# Altium project ControlBoard.PrjPCB
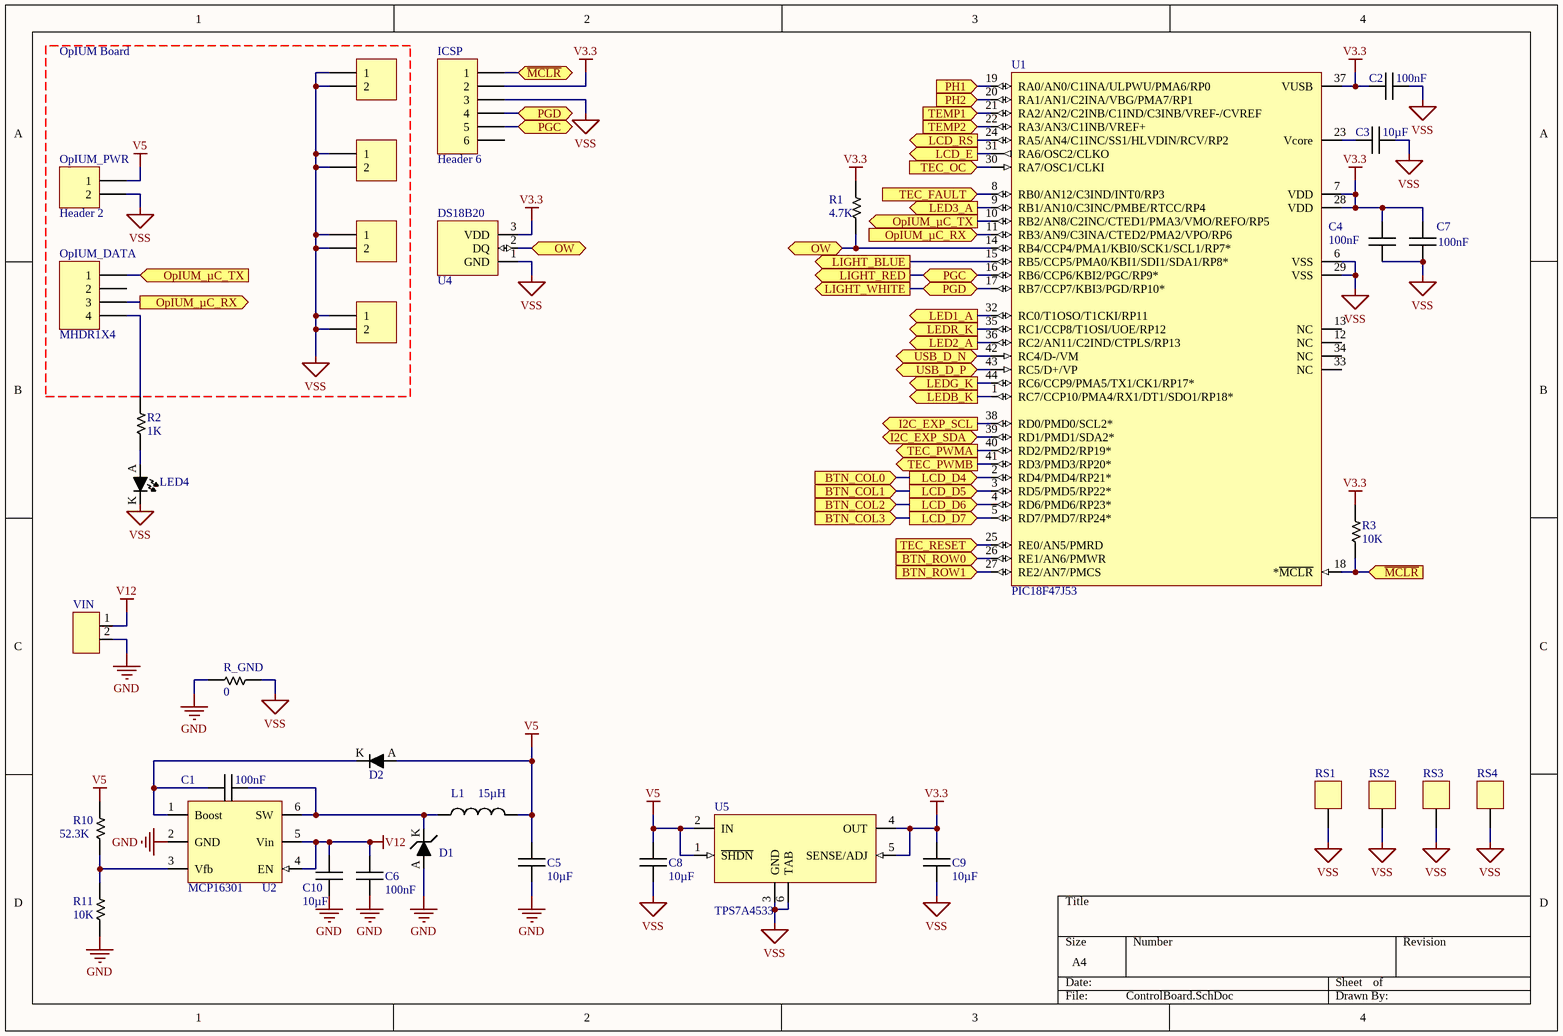
[diagram p0: ControlBoard.SchDoc]
3 sheets, 137 parts. Net scope: flat (ports and power ports of the same name join across sheets).
Board file: ControlBoard.PcbDoc
Sheets:
  ControlBoard.SchDoc
  PowerBoard.SchDoc
  IOBoard.SchDoc

## Sheet ControlBoard.SchDoc
size A4

### Parts
C1  100nF  [CAPC1608N]
C2  100nF  [CAPC1608N]
C3  10µF  [CAPC2012N]
C4  100nF  [CAPC1608N]
C5  10µF  [CAPC2012N]
C6  100nF  [CAPC1608N]
C7  100nF  [CAPC1608N]
C8  10µF  [CAPC2012N]
C9  10µF  [CAPC2012N]
C10  10µF  [CAPC3225N]
D1  Schottky Diode  [DO-214AC]  (value not drawn)
D2  Diode  [SOT323]  (value not drawn)
ICSP  Header 6  [HDR1X6]
L1  15µH  [INDUCTOR 6×6mm Taiyo Yuden]
LED4  (no value)  [LED 1608m]
OpIUM_DATA  MHDR1X4  [MHDR1X4]
OpIUM_PWR  Header 2  [HDR1X2]
R1  4.7K  [RESC1608N]
R2  1K  [RESC1608N]
R3  10K  [RESC1608N]
R10  52.3K  [RESC1608N]
R11  10K  [RESC1608N]
R_GND  0  [RESC1608N]
RS1  PCB Riser  [PCB Riser 6×10mm 3mm]  (value not drawn)
RS2  PCB Riser  [PCB Riser 6×10mm 3mm]  (value not drawn)
RS3  PCB Riser  [PCB Riser 6×10mm 3mm]  (value not drawn)
RS4  PCB Riser  [PCB Riser 6×10mm 3mm]  (value not drawn)
SUPPORT1  MHDR1X2  [MHDR1X2]  (value not drawn)
SUPPORT2  MHDR1X2  [MHDR1X2]  (value not drawn)
SUPPORT3  MHDR1X2  [MHDR1X2]  (value not drawn)
SUPPORT4  MHDR1X2  [MHDR1X2]  (value not drawn)
U1  PIC18F47J53  [TQFP-PT44_N]
U2  MCP16301  [SOT23-6_N]
U4  DS18B20  [TO-92A]
U5  TPS7A4533  [SOT223-6N]
VIN  High-Power Connector 2p  [High-Power Connector 2]  (value not drawn)

### Ports
BTN_COL0 (in), BTN_COL1 (in), BTN_COL2 (in), BTN_COL3 (in), BTN_ROW0 (in), BTN_ROW1 (in), I2C_EXP_SCL (out), I2C_EXP_SDA (bidir), LCD_D4 (out), LCD_D5 (out), LCD_D6 (out), LCD_D7 (out), LCD_E (out), LCD_RS (out), LED1_A (out), LED2_A (out), LED3_A (out), LEDB_K (out), LEDG_K (out), LEDR_K (out), LIGHT_BLUE (out), LIGHT_RED (out), LIGHT_WHITE (out), OpIUM_µC_RX (in), OpIUM_µC_RX (out), OpIUM_µC_TX (in), OpIUM_µC_TX (out), OW (bidir), PGC (bidir), PGD (bidir), PH1 (in), PH2 (in), TEC_FAULT (in), TEC_OC (in), TEC_PWMA (out), TEC_PWMB (out), TEC_RESET (in), TEMP1 (in), TEMP2 (in), USB_D_N (bidir), USB_D_P (bidir), ~{MCLR} (bidir), ~{MCLR} (in)

### Nets
GND: C5.1 C6.2 C10.1 D1.A(Anode) R11.1 R_GND.1 U2.2(GND) VIN.2
V3.3: C2.2 C4.2 C7.2 C9.2 ICSP.2 R1.2 R3.2 U1.7(VDD) U1.28(VDD) U1.37(VUSB) U4.3(VDD) U5.4(OUT) U5.5(SENSE/ADJ)
V5: C5.2 C8.2 D2.A L1.2 OpIUM_PWR.1 R10.2 U5.1(~{SHDN}) U5.2(IN)
V12: C6.1 C10.2 U2.4(EN) U2.5(Vin) VIN.1
VSS: C2.1 C3.1 C4.1 C7.1 C8.1 C9.1 ICSP.3 LED4.K OpIUM_PWR.2 R_GND.2 RS1.1 RS2.1 RS3.1 RS4.1 SUPPORT1.1 SUPPORT1.2 SUPPORT2.1 SUPPORT2.2 SUPPORT3.1 SUPPORT3.2 SUPPORT4.1 SUPPORT4.2 U1.6(VSS) U1.29(VSS) U4.1(GND) U5.3(GND) U5.6(TAB)
USB_D_N: U1.42(RC4/D-/VM) ; port USB_D_N
USB_D_P: U1.43(RC5/D+/VP) ; port USB_D_P
NetB1_1: U1.27(RE2/AN7/PMCS) ; port BTN_ROW1
NetB1_2: U1.2(RD4/PMD4/RP21*) ; port LCD_D4, port BTN_COL0
NetB2_1: U1.26(RE1/AN6/PMWR) ; port BTN_ROW0
NetB3_2: U1.3(RD5/PMD5/RP22*) ; port LCD_D5, port BTN_COL1
NetB5_2: U1.4(RD6/PMD6/RP23*) ; port LCD_D6, port BTN_COL2
NetB7_2: U1.5(RD7/PMD7/RP24*) ; port LCD_D7, port BTN_COL3
NetC1_1: C1.1 D1.K(Kathode) L1.1 U2.6(SW)
NetC1_2: C1.2 D2.K U2.1(Boost)
NetC3_2: C3.2 U1.23(Vcore)
NetEXP_I2C_2: U1.38(RD0/PMD0/SCL2*) ; port I2C_EXP_SCL
NetEXP_I2C_3: U1.39(RD1/PMD1/SDA2*) ; port I2C_EXP_SDA
NetEXP_OW_2: R1.1 U1.14(RB4/CCP4/PMA1/KBI0/SCK1/SCL1/RP7*) U4.2(DQ) ; port OW
NetICSP_1: ICSP.1 R3.1 U1.18(*~{MCLR}) ; port ~{MCLR}
NetICSP_4: ICSP.4 U1.17(RB7/CCP7/KBI3/PGD/RP10*) ; port PGD, port LIGHT_WHITE
NetICSP_5: ICSP.5 U1.16(RB6/CCP6/KBI2/PGC/RP9*) ; port PGC, port LIGHT_RED
NetLCD_4: U1.24(RA5/AN4/C1INC/SS1/HLVDIN/RCV/RP2) ; port LCD_RS
NetLCD_6: U1.31(RA6/OSC2/CLKO) ; port LCD_E
NetLED1_AB: U1.32(RC0/T1OSO/T1CKI/RP11) ; port LED1_A
NetLED2_AB: U1.36(RC2/AN11/C2IND/CTPLS/RP13) ; port LED2_A
NetLED3_AB: U1.9(RB1/AN10/C3INC/PMBE/RTCC/RP4) ; port LED3_A
NetLED4_A: LED4.A R2.1
NetOpIUM_DATA_1: OpIUM_DATA.1 U1.10(RB2/AN8/C2INC/CTED1/PMA3/VMO/REFO/RP5) ; port OpIUM_µC_TX
NetOpIUM_DATA_3: OpIUM_DATA.3 U1.11(RB3/AN9/C3INA/CTED2/PMA2/VPO/RP6) ; port OpIUM_µC_RX
NetOpIUM_DATA_4: OpIUM_DATA.4 R2.2
NetR4_2: U1.35(RC1/CCP8/T1OSI/UOE/RP12) ; port LEDR_K
NetR5_2: U1.44(RC6/CCP9/PMA5/TX1/CK1/RP17*) ; port LEDG_K
NetR6_2: U1.1(RC7/CCP10/PMA4/RX1/DT1/SDO1/RP18*) ; port LEDB_K
NetR10_1: R10.1 R11.2 U2.3(Vfb)
NetR22_2: U1.25(RE0/AN5/PMRD) ; port TEC_RESET
NetR25_1: U1.15(RB5/CCP5/PMA0/KBI1/SDI1/SDA1/RP8*) ; port LIGHT_BLUE
NetR36_2: U1.19(RA0/AN0/C1INA/ULPWU/PMA6/RP0) ; port PH1
NetR37_2: U1.20(RA1/AN1/C2INA/VBG/PMA7/RP1) ; port PH2
NetTEMP1_2: U1.21(RA2/AN2/C2INB/C1IND/C3INB/VREF-/CVREF) ; port TEMP1
NetTEMP2_2: U1.22(RA3/AN3/C1INB/VREF+) ; port TEMP2
NetU1_8: U1.8(RB0/AN12/C3IND/INT0/RP3) ; port TEC_FAULT
NetU1_30: U1.30(RA7/OSC1/CLKI) ; port TEC_OC
NetU1_40: U1.40(RD2/PMD2/RP19*) ; port TEC_PWMA
NetU1_41: U1.41(RD3/PMD3/RP20*) ; port TEC_PWMB

Not connected (* = marked no-connect by the designer): ICSP 6; OpIUM_DATA 2; U1 12(NC) 13(NC) 33(NC) 34(NC)

### Notes on the sheet
- OpIUM Board

### Library data of the parts
C1 C6 = Capacitor: Voltage Rating: 50V; Value: 100nF
C2-C5 C7-C10 = Capacitor
  C2 C4 C7: Value: 100nF
  C3 C5 C8-C10: Value: 10µF
D1 = Schottky Diode: Model: SS14
D2 = Diode: pin to pad: A>1 K>3; Model: M1MA141KT1G
ICSP = Header 6: Header, 6-Pin; LatestRevisionDate: 17-Jul-2002; LatestRevisionNote: Re-released for DXP Platform.; Publisher: Altium Limited
L1 = Inductor: Value: 15µH
LED4 = LED: pin to pad: A>1 K>2
OpIUM_DATA = MHDR1X4: Header, 4-Pin; LatestRevisionDate: 17-Jul-2002; LatestRevisionNote: Re-released for DXP Platform.; Publisher: Altium Limited
OpIUM_PWR = Header 2: Header, 2-Pin; LatestRevisionDate: 17-Jul-2002; LatestRevisionNote: Re-released for DXP Platform.; Publisher: Altium Limited
R1-R3 R10 R11 R_GND = Resistor
  R1: Value: 4.7K
  R2: Value: 1K
  R3 R11: Value: 10K
  R10: Value: 52.3K
  R_GND: Value: 0
SUPPORT1-SUPPORT4 = MHDR1X2: Header, 2-Pin; LatestRevisionDate: 17-Jul-2002; LatestRevisionNote: Re-released for DXP Platform.; Publisher: Altium Limited
U5 = TPS7A45xx: VIN: 5V; VOUT: 3.3V
RS1-RS4 = PCB Riser: Height: 10mm
U2 = MCP16301: Vout: *

## Sheet PowerBoard.SchDoc
size A4
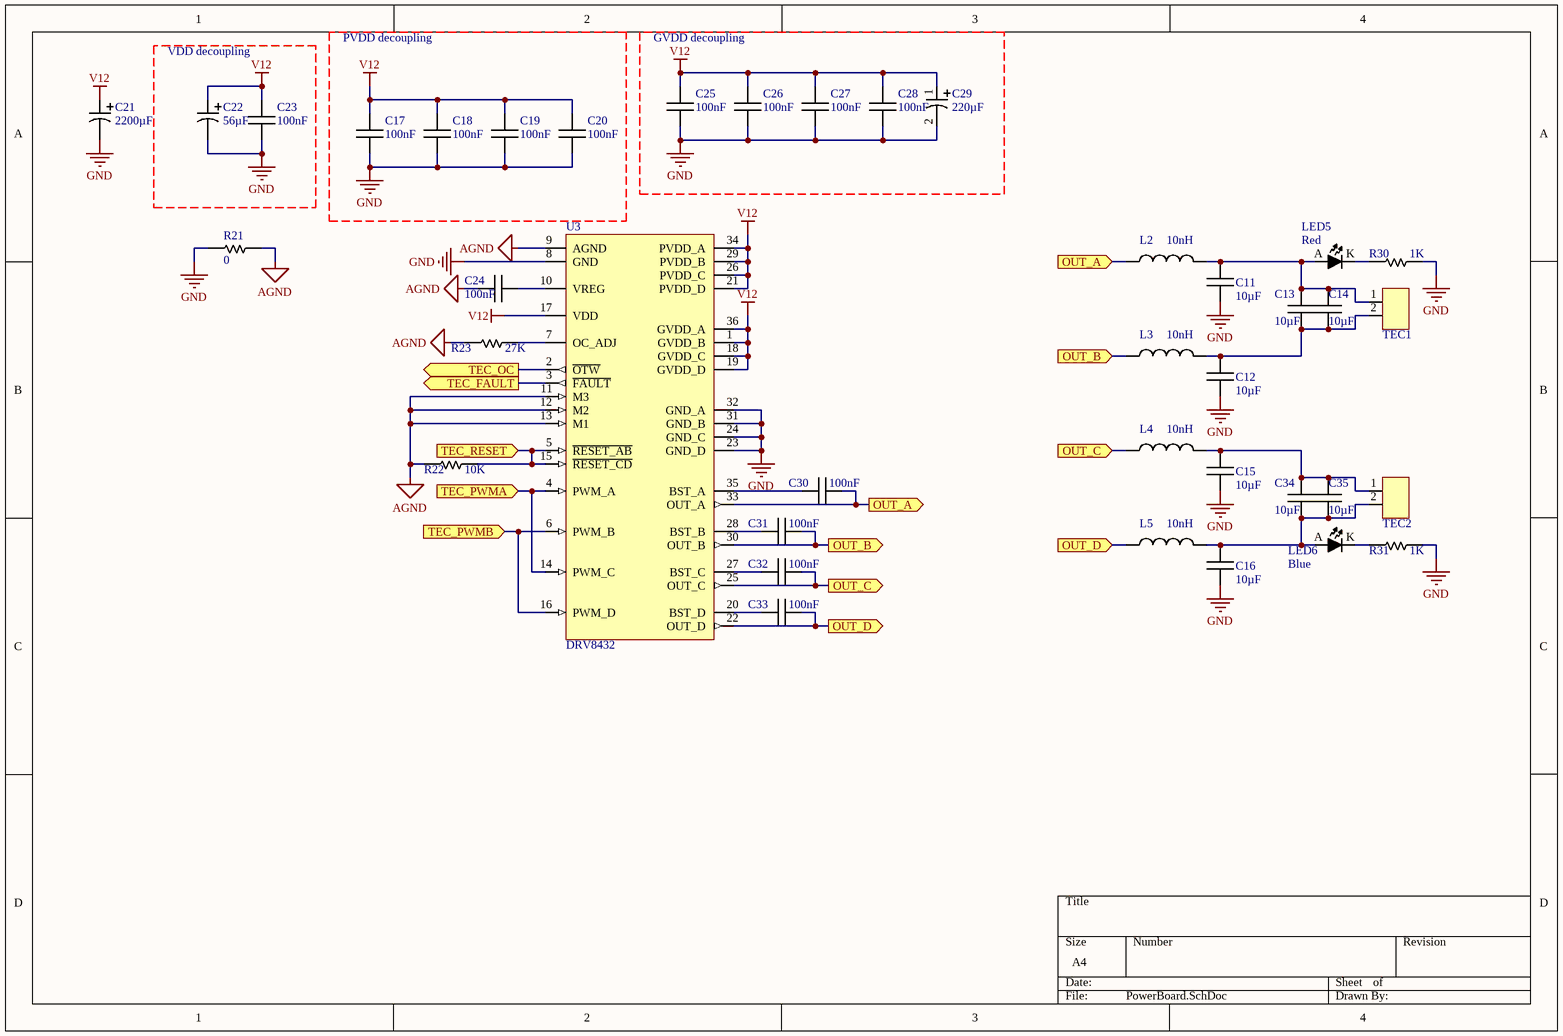
[diagram p1: PowerBoard.SchDoc]

### Parts
C11  10µF  [CAPC3225N]
C12  10µF  [CAPC3225N]
C13  10µF  [CAPC3225N]
C14  10µF  [CAPC3225N]
C15  10µF  [CAPC3225N]
C16  10µF  [CAPC3225N]
C17  100nF  [CAPC1608N]
C18  100nF  [CAPC1608N]
C19  100nF  [CAPC1608N]
C20  100nF  [CAPC1608N]
C21  2200µF  [CAPPR7.5-18x35.5]
C22  56µF  [CAPPR2.5-6.3x15]
C23  100nF  [CAPC1608N]
C24  100nF  [CAPC1608N]
C25  100nF  [CAPC1608N]
C26  100nF  [CAPC1608N]
C27  100nF  [CAPC1608N]
C28  100nF  [CAPC1608N]
C29  220µF  [CAPPR3.5-8x15]
C30  100nF  [CAPC1608N]
C31  100nF  [CAPC1608N]
C32  100nF  [CAPC1608N]
C33  100nF  [CAPC1608N]
C34  10µF  [CAPC3225N]
C35  10µF  [CAPC3225N]
L2  10nH  [Inductor 9.1×7.6mm TH]
L3  10nH  [Inductor 9.1×7.6mm TH]
L4  10nH  [Inductor 9.1×7.6mm TH]
L5  10nH  [Inductor 9.1×7.6mm TH]
LED5  Red  [LED 1608m]
LED6  Blue  [LED 1608m]
R21  0  [RESC1608N]
R22  10K  [RESC1608N]
R23  27K  [RESC2012N]
R30  1K  [RESC1608N]
R31  1K  [RESC1608N]
TEC1  High-Power Connector 2p  [High-Power Connector 2]  (value not drawn)
TEC2  High-Power Connector 2p  [High-Power Connector 2]  (value not drawn)
U3  DRV8432  [PSOP3-36]

### Ports
OUT_A (in), OUT_A (out), OUT_B (in), OUT_B (out), OUT_C (in), OUT_C (out), OUT_D (in), OUT_D (out), TEC_FAULT (out), TEC_OC (out), TEC_PWMA (in), TEC_PWMB (in), TEC_RESET (in)

### Nets
AGND: C24.2 R21.2 R22.1 R23.1 U3.9(AGND) U3.11(M3) U3.12(M2) U3.13(M1)
GND: C11.1 C12.1 C15.1 C16.1 C17.1 C18.1 C19.1 C20.1 C21.2 C22.2 C23.1 C25.1 C26.1 C27.1 C28.1 C29.2 R21.1 R30.2 R31.2 U3.8(GND) U3.23(GND_D) U3.24(GND_C) U3.31(GND_B) U3.32(GND_A)
V12: C17.2 C18.2 C19.2 C20.2 C21.1 C22.1 C23.2 C25.2 C26.2 C27.2 C28.2 C29.1 U3.1(GVDD_B) U3.17(VDD) U3.18(GVDD_C) U3.19(GVDD_D) U3.21(PVDD_D) U3.26(PVDD_C) U3.29(PVDD_B) U3.34(PVDD_A) U3.36(GVDD_A)
NetC11_2: C11.2 C13.2 C14.2 L2.2 LED5.A TEC1.1
NetC12_2: C12.2 C13.1 C14.1 L3.2 TEC1.2
NetC15_2: C15.2 C34.2 C35.2 L4.2 TEC2.1
NetC16_2: C16.2 C34.1 C35.1 L5.2 LED6.A TEC2.2
NetC24_1: C24.1 U3.10(VREG)
NetC30_1: C30.1 U3.35(BST_A)
NetC30_2: C30.2 L2.1 U3.33(OUT_A) ; port OUT_A
NetC31_1: C31.1 U3.28(BST_B)
NetC31_2: C31.2 L3.1 U3.30(OUT_B) ; port OUT_B
NetC32_1: C32.1 U3.27(BST_C)
NetC32_2: C32.2 L4.1 U3.25(OUT_C) ; port OUT_C
NetC33_1: C33.1 U3.20(BST_D)
NetC33_2: C33.2 L5.1 U3.22(OUT_D) ; port OUT_D
NetLED5_K: LED5.K R30.1
NetLED6_K: LED6.K R31.1
NetR22_2: R22.2 U3.5(~{RESET_AB}) U3.15(~{RESET_CD}) ; port TEC_RESET
NetR23_2: R23.2 U3.7(OC_ADJ)
NetU1_8: U3.3(~{FAULT}) ; port TEC_FAULT
NetU1_30: U3.2(~{OTW}) ; port TEC_OC
NetU1_40: U3.4(PWM_A) U3.14(PWM_C) ; port TEC_PWMA
NetU1_41: U3.6(PWM_B) U3.16(PWM_D) ; port TEC_PWMB

### Notes on the sheet
- PVDD decoupling
- GVDD decoupling
- VDD decoupling

### Library data of the parts
C11-C20 C23-C28 C30-C35 = Capacitor
  C11-C16 C34 C35: Value: 10µF
  C17-C20 C23-C28 C30-C33: Value: 100nF
C21 C22 = Capacitor Polarised: Voltage Rating: 25V
  C21: Value: 2200µF
  C22: Value: 56µF
C29 = Capacitor Polarised: Voltage rating: 25V; Value: 220µF
L2-L5 = Inductor: Value: 10nH
LED5 LED6 = LED: pin to pad: A>1 K>2
  LED5: Color: Red
  LED6: Color: Blue
R21-R23 R30 R31 = Resistor
  R21: Value: 0
  R22: Value: 10K
  R23: Value: 27K
  R30 R31: Value: 1K

## Sheet IOBoard.SchDoc
size A4
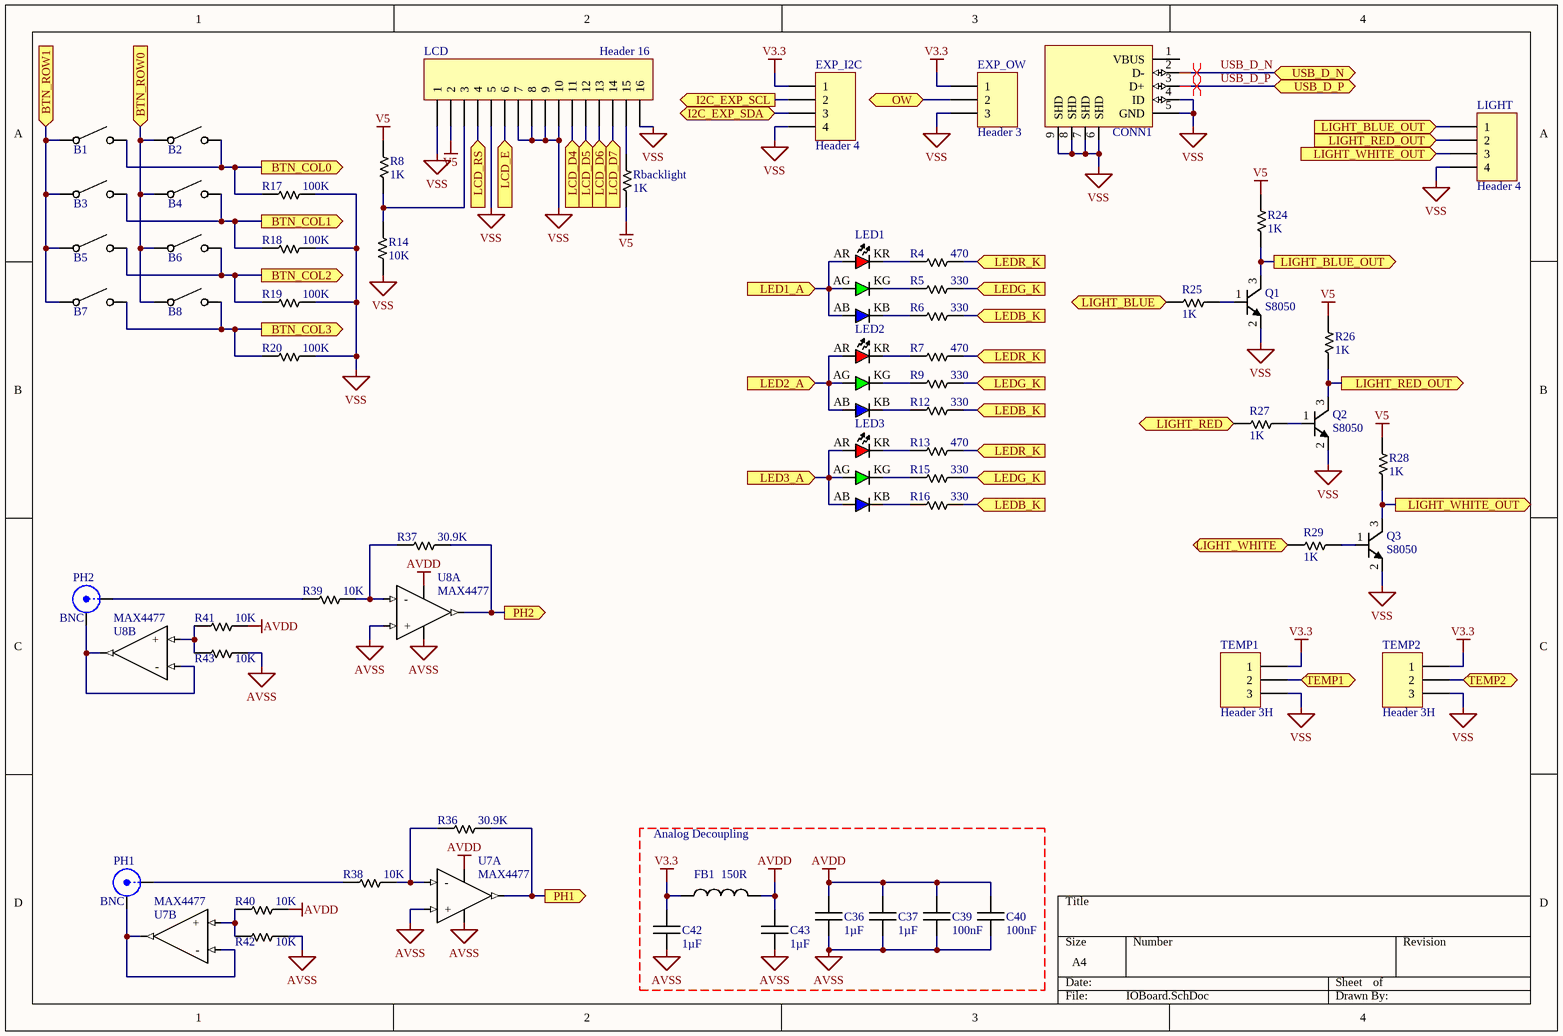
[diagram p2: IOBoard.SchDoc]

### Parts
B1  Tact Button NO  [Tact TH 4pin 6×6mm]  (value not drawn)
B2  Tact Button NO  [Tact TH 4pin 6×6mm]  (value not drawn)
B3  Tact Button NO  [Tact TH 4pin 6×6mm]  (value not drawn)
B4  Tact Button NO  [Tact TH 4pin 6×6mm]  (value not drawn)
B5  Tact Button NO  [Tact TH 4pin 6×6mm]  (value not drawn)
B6  Tact Button NO  [Tact TH 4pin 6×6mm]  (value not drawn)
B7  Tact Button NO  [Tact TH 4pin 6×6mm]  (value not drawn)
B8  Tact Button NO  [Tact TH 4pin 6×6mm]  (value not drawn)
C36  1µF  [CAPC1608N]
C37  1µF  [CAPC1608N]
C39  100nF  [CAPC1608N]
C40  100nF  [CAPC1608N]
C42  1µF  [CAPC1608N]
C43  1µF  [CAPC1608N]
CONN1  USB-Conn Mini-B SMD  [440478]  (value not drawn)
EXP_I2C  Header 4  [HDR1X4]
EXP_OW  Header 3  [HDR1X3]
FB1  150R  [INDC1608N]
LCD  Header 16  [HDR1X16]
LED1  LED RGB  [LED PLCC-6]  (value not drawn)
LED2  LED RGB  [LED PLCC-6]  (value not drawn)
LED3  LED RGB  [LED PLCC-6]  (value not drawn)
LIGHT  Header 4  [HDR1X4]
PH1  BNC  [BNC_RA CON]
PH2  BNC  [BNC_RA CON]
Q1  S8050  [SOT23]
Q2  S8050  [SOT23]
Q3  S8050  [SOT23]
R4  470  [RESC2012N]
R5  330  [RESC2012N]
R6  330  [RESC2012N]
R7  470  [RESC2012N]
R8  1K  [RESC1608N]
R9  330  [RESC2012N]
R12  330  [RESC2012N]
R13  470  [RESC2012N]
R14  10K  [RESC1608N]
R15  330  [RESC2012N]
R16  330  [RESC2012N]
R17  100K  [RESC1608N]
R18  100K  [RESC1608N]
R19  100K  [RESC1608N]
R20  100K  [RESC1608N]
R24  1K  [RESC1608N]
R25  1K  [RESC1608N]
R26  1K  [RESC1608N]
R27  1K  [RESC1608N]
R28  1K  [RESC1608N]
R29  1K  [RESC1608N]
R36  30.9K  [RESC1608N]
R37  30.9K  [RESC1608N]
R38  10K  [RESC1608N]
R39  10K  [RESC1608N]
R40  10K  [RESC1608N]
R41  10K  [RESC1608N]
R42  10K  [RESC1608N]
R43  10K  [RESC1608N]
Rbacklight  1K  [RESC1608N]
TEMP1  Header 3H  [HDR1X3H]
TEMP2  Header 3H  [HDR1X3H]
U7  MAX4477  [UMAX8_N]  (parts A,B of 2)
U8  MAX4477  [UMAX8_N]  (parts A,B of 2)

### Ports
BTN_COL0 (out), BTN_COL1 (out), BTN_COL2 (out), BTN_COL3 (out), BTN_ROW0 (in), BTN_ROW1 (in), I2C_EXP_SCL (out), I2C_EXP_SDA (bidir), LCD_D4 (in), LCD_D5 (in), LCD_D6 (in), LCD_D7 (in), LCD_E (in), LCD_RS (in), LED1_A (in), LED2_A (in), LED3_A (in), LEDB_K (in), LEDG_K (in), LEDR_K (in), LIGHT_BLUE (in), LIGHT_BLUE_OUT (in), LIGHT_BLUE_OUT (out), LIGHT_RED (in), LIGHT_RED_OUT (in), LIGHT_RED_OUT (out), LIGHT_WHITE (in), LIGHT_WHITE_OUT (in), LIGHT_WHITE_OUT (out), OW (bidir), PH1 (out), PH2 (out), TEMP1 (bidir), TEMP2 (bidir), USB_D_N (bidir), USB_D_P (bidir)

### Nets
AVDD: C36.2 C37.2 C39.2 C40.2 C43.2 FB1.2 R40.2 R41.2 U7.8(V+) U8.8(V+)
AVSS: C36.1 C37.1 C39.1 C40.1 C42.1 C43.1 R42.2 R43.2 U7.3(+) U7.4(V-) U8.3(+) U8.4(V-)
V3.3: C42.2 EXP_I2C.1 EXP_OW.1 FB1.1 TEMP1.1 TEMP2.1
V5: LCD.2 R8.2 R24.2 R26.2 R28.2 Rbacklight.1
VSS: CONN1.4(ID) CONN1.5(GND) CONN1.6(SHD) CONN1.7(SHD) CONN1.8(SHD) CONN1.9(SHD) EXP_I2C.4 EXP_OW.3 LCD.1 LCD.5 LCD.7 LCD.8 LCD.9 LCD.10 LCD.16 LIGHT.4 Q1.2(E) Q2.2(E) Q3.2(E) R14.2 R17.2 R18.2 R19.2 R20.2 TEMP1.3 TEMP2.3
USB_D_N: CONN1.2(D-) ; port USB_D_N
USB_D_P: CONN1.3(D+) ; port USB_D_P
NetB1_1: B1.1 B3.1 B5.1 B7.1 ; port BTN_ROW1
NetB1_2: B1.2 B2.2 LCD.11 R17.1 ; port BTN_COL0, port LCD_D4
NetB2_1: B2.1 B4.1 B6.1 B8.1 ; port BTN_ROW0
NetB3_2: B3.2 B4.2 LCD.12 R18.1 ; port BTN_COL1, port LCD_D5
NetB5_2: B5.2 B6.2 LCD.13 R19.1 ; port BTN_COL2, port LCD_D6
NetB7_2: B7.2 B8.2 LCD.14 R20.1 ; port BTN_COL3, port LCD_D7
NetEXP_I2C_2: EXP_I2C.2 ; port I2C_EXP_SCL
NetEXP_I2C_3: EXP_I2C.3 ; port I2C_EXP_SDA
NetEXP_OW_2: EXP_OW.2 ; port OW
NetICSP_4: R29.1 ; port LIGHT_WHITE
NetICSP_5: R27.1 ; port LIGHT_RED
NetLCD_3: LCD.3 R8.1 R14.1
NetLCD_4: LCD.4 ; port LCD_RS
NetLCD_6: LCD.6 ; port LCD_E
NetLCD_15: LCD.15 Rbacklight.2
NetLED1_AB: LED1.AB LED1.AG LED1.AR ; port LED1_A
NetLED1_KB: LED1.KB R6.1
NetLED1_KG: LED1.KG R5.1
NetLED1_KR: LED1.KR R4.1
NetLED2_AB: LED2.AB LED2.AG LED2.AR ; port LED2_A
NetLED2_KB: LED2.KB R12.1
NetLED2_KG: LED2.KG R9.1
NetLED2_KR: LED2.KR R7.1
NetLED3_AB: LED3.AB LED3.AG LED3.AR ; port LED3_A
NetLED3_KB: LED3.KB R16.1
NetLED3_KG: LED3.KG R15.1
NetLED3_KR: LED3.KR R13.1
NetLIGHT_1: LIGHT.1 Q1.3(C) R24.1 ; port LIGHT_BLUE_OUT
NetLIGHT_2: LIGHT.2 Q2.3(C) R26.1 ; port LIGHT_RED_OUT
NetLIGHT_3: LIGHT.3 Q3.3(C) R28.1 ; port LIGHT_WHITE_OUT
NetPH1_1: PH1.1(X) R38.1
NetPH1_2: PH1.2(Y) U7.6(-) U7.7(O)
NetPH2_1: PH2.1(X) R39.1
NetPH2_2: PH2.2(Y) U8.6(-) U8.7(O)
NetQ1_1: Q1.1(B) R25.2
NetQ2_1: Q2.1(B) R27.2
NetQ3_1: Q3.1(B) R29.2
NetR4_2: R4.2 R7.2 R13.2 ; port LEDR_K
NetR5_2: R5.2 R9.2 R15.2 ; port LEDG_K
NetR6_2: R6.2 R12.2 R16.2 ; port LEDB_K
NetR25_1: R25.1 ; port LIGHT_BLUE
NetR36_1: R36.1 R38.2 U7.2(-)
NetR36_2: R36.2 U7.1(O) ; port PH1
NetR37_1: R37.1 R39.2 U8.2(-)
NetR37_2: R37.2 U8.1(O) ; port PH2
NetR40_1: R40.1 R42.1 U7.5(+)
NetR41_1: R41.1 R43.1 U8.5(+)
NetTEMP1_2: TEMP1.2 ; port TEMP1
NetTEMP2_2: TEMP2.2 ; port TEMP2

Not connected (* = marked no-connect by the designer): CONN1 1(VBUS)

### Layout directives
differential pair: USB_D_N, USB_D_P

### Notes on the sheet
- Analog Decoupling

### Library data of the parts
B1-B8 = Tact Button NO: pin to pad: 1>1+3 2>2+4
C36 C37 C39 C40 C42 C43 = Capacitor
  C36 C37 C42 C43: Value: 1µF
  C39 C40: Value: 100nF
EXP_I2C LIGHT = Header 4: Header, 4-Pin; LatestRevisionDate: 17-Jul-2002; LatestRevisionNote: Re-released for DXP Platform.; Publisher: Altium Limited
EXP_OW = Header 3: Header, 3-Pin; LatestRevisionDate: 17-Jul-2002; LatestRevisionNote: Re-released for DXP Platform.; Publisher: Altium Limited
FB1 = Inductor: Value: 150R
LCD = Header 16: Header, 16-Pin; LatestRevisionDate: 17-Jul-2002; LatestRevisionNote: Re-released for DXP Platform.; Publisher: Altium Limited
LED1-LED3 = LED RGB: pin to pad: AB>6 AG>2 AR>4 KB>5 KG>1 KR>3
PH1 PH2 = BNC: BNC Elbow Connector; LatestRevisionDate: 17-Jul-2002; LatestRevisionNote: Re-released for DXP Platform.; Publisher: Altium Limited
Q1-Q3 = NPN: Model: S8050
R4-R9 R12-R20 R24-R29 R36-R43 Rbacklight = Resistor
  R4 R7 R13: Value: 470
  R5 R6 R9 R12 R15 R16: Value: 330
  R8 R24-R29 Rbacklight: Value: 1K
  R14 R38-R43: Value: 10K
  R17-R20: Value: 100K
  R36 R37: Value: 30.9K
TEMP1 TEMP2 = Header 3H: Header, 3-Pin, Right Angle; LatestRevisionDate: 17-Jul-2002; LatestRevisionNote: Re-released for DXP Platform.; Publisher: Altium Limited
U7 U8 = Opamp dual: Model: MAX4477

## Nets that join several sheets
GND: ControlBoard (8 pins), PowerBoard (24 pins)
V3.3: ControlBoard (13 pins), IOBoard (6 pins)
V5: ControlBoard (8 pins), IOBoard (6 pins)
V12: ControlBoard (5 pins), PowerBoard (21 pins)
VSS: ControlBoard (27 pins), IOBoard (26 pins)
NetB1_1: ControlBoard (U1.27), IOBoard (B1.1 B3.1 B5.1 B7.1)
NetB1_2: ControlBoard (U1.2), IOBoard (B1.2 B2.2 LCD.11 R17.1)
NetB2_1: ControlBoard (U1.26), IOBoard (B2.1 B4.1 B6.1 B8.1)
NetB3_2: ControlBoard (U1.3), IOBoard (B3.2 B4.2 LCD.12 R18.1)
NetB5_2: ControlBoard (U1.4), IOBoard (B5.2 B6.2 LCD.13 R19.1)
NetB7_2: ControlBoard (U1.5), IOBoard (B7.2 B8.2 LCD.14 R20.1)
NetEXP_I2C_2: ControlBoard (U1.38), IOBoard (EXP_I2C.2)
NetEXP_I2C_3: ControlBoard (U1.39), IOBoard (EXP_I2C.3)
NetEXP_OW_2: ControlBoard (R1.1 U1.14 U4.2), IOBoard (EXP_OW.2)
NetICSP_4: ControlBoard (ICSP.4 U1.17), IOBoard (R29.1)
NetICSP_5: ControlBoard (ICSP.5 U1.16), IOBoard (R27.1)
NetLCD_4: ControlBoard (U1.24), IOBoard (LCD.4)
NetLCD_6: ControlBoard (U1.31), IOBoard (LCD.6)
NetLED1_AB: ControlBoard (U1.32), IOBoard (LED1.AB LED1.AG LED1.AR)
NetLED2_AB: ControlBoard (U1.36), IOBoard (LED2.AB LED2.AG LED2.AR)
NetLED3_AB: ControlBoard (U1.9), IOBoard (LED3.AB LED3.AG LED3.AR)
NetR4_2: ControlBoard (U1.35), IOBoard (R4.2 R7.2 R13.2)
NetR5_2: ControlBoard (U1.44), IOBoard (R5.2 R9.2 R15.2)
NetR6_2: ControlBoard (U1.1), IOBoard (R6.2 R12.2 R16.2)
NetR22_2: ControlBoard (U1.25), PowerBoard (R22.2 U3.5 U3.15)
NetR25_1: ControlBoard (U1.15), IOBoard (R25.1)
NetR36_2: ControlBoard (U1.19), IOBoard (R36.2 U7.1)
NetR37_2: ControlBoard (U1.20), IOBoard (R37.2 U8.1)
NetTEMP1_2: ControlBoard (U1.21), IOBoard (TEMP1.2)
NetTEMP2_2: ControlBoard (U1.22), IOBoard (TEMP2.2)
NetU1_8: ControlBoard (U1.8), PowerBoard (U3.3)
NetU1_30: ControlBoard (U1.30), PowerBoard (U3.2)
NetU1_40: ControlBoard (U1.40), PowerBoard (U3.4 U3.14)
NetU1_41: ControlBoard (U1.41), PowerBoard (U3.6 U3.16)
USB_D_N: ControlBoard (U1.42), IOBoard (CONN1.2)
USB_D_P: ControlBoard (U1.43), IOBoard (CONN1.3)